# EAGLE schematic cardimetry_schematic (EAGLE 9.7.0)
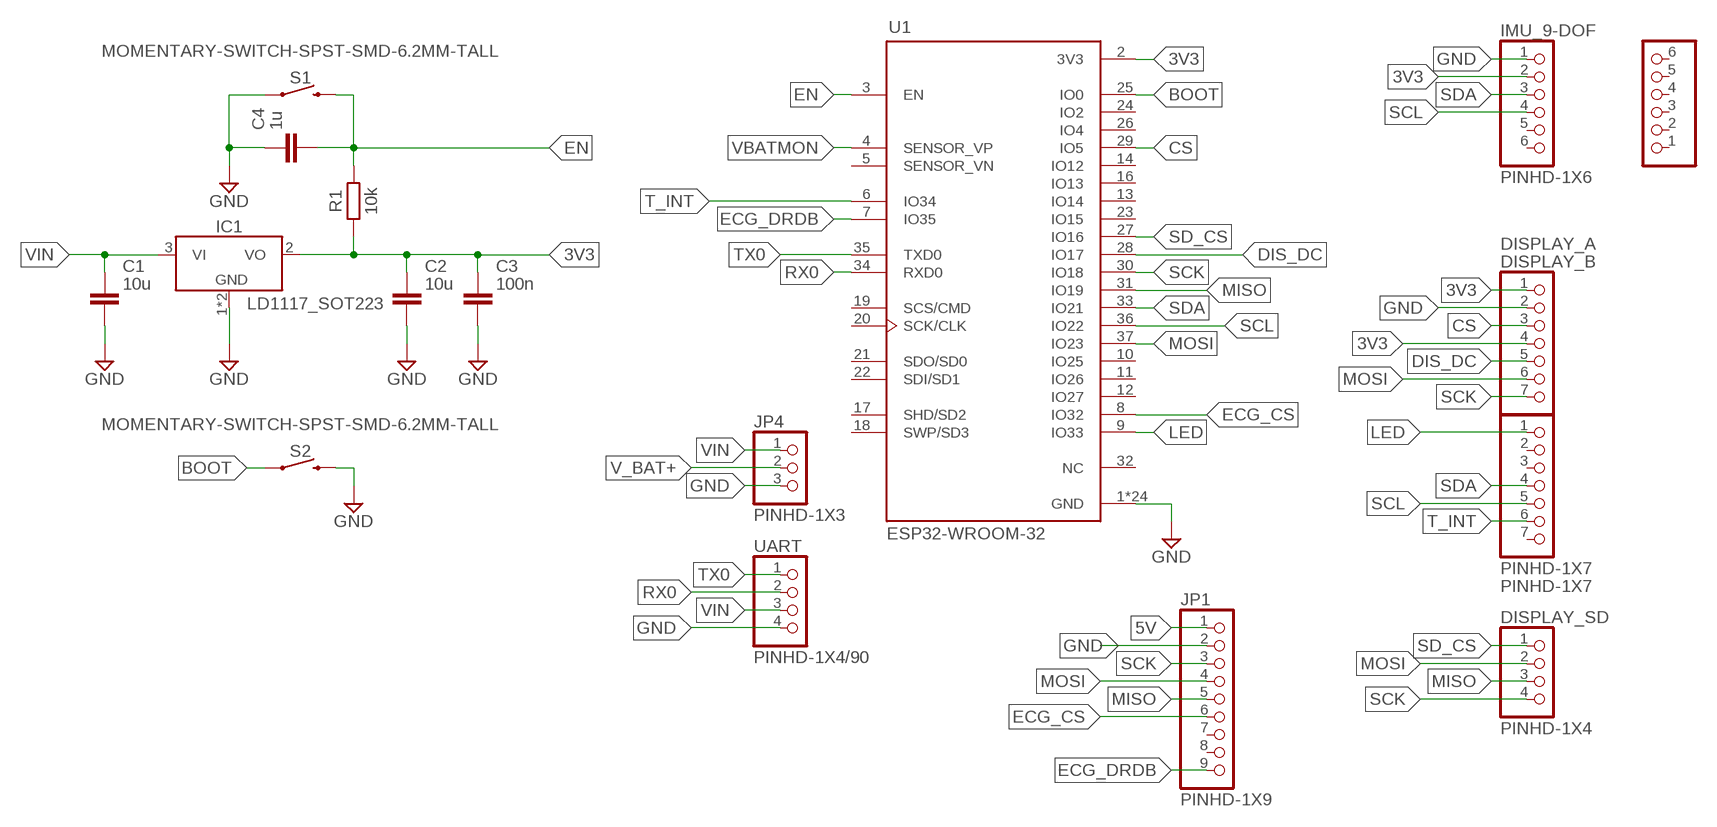
[diagram p0: schematic, sheet 1]

## Parts
C1  10u  C_CHIP-0805(2012-METRIC)  [CAPC2012X110]
C2  10u  C_CHIP-0805(2012-METRIC)  [CAPC2012X110]
C3  100n  C_CHIP-0805(2012-METRIC)  [CAPC2012X110]
C4  1u  C_CHIP-0805(2012-METRIC)  [CAPC2012X110]
DISPLAY_A  PINHD-1X7  [1X07]
DISPLAY_B  PINHD-1X7  [1X07]
DISPLAY_SD  PINHD-1X4  [1X04]
IC1  LD1117_SOT223  [SOT230P700X170-4]
IMU_9-DOF  PINHD-1X6  [1X06]
JP1  PINHD-1X9  [1X09]
JP3  PINHD-1X6  [1X06]
JP4  PINHD-1X3  [1X03]
R1  10k  R_CHIP-0805(2012-METRIC)  [RESC2012X65]
S1  MOMENTARY-SWITCH-SPST-SMD-6.2MM-TALL  [TACTILE_SWITCH_SMD_6.2MM_TALL]
S2  MOMENTARY-SWITCH-SPST-SMD-6.2MM-TALL  [TACTILE_SWITCH_SMD_6.2MM_TALL]
U1  ESP32-WROOM-32  [MODULE_ESP32-WROOM-32]
UART  PINHD-1X4/90  [1X04/90]

## Nets
3V3: C2.1 C3.1 DISPLAY_A.1 DISPLAY_A.4 IC1.2(VO) IMU_9-DOF.2 R1.1 U1.2(3V3)
5V: JP1.1
BOOT: S2.A2 U1.25(IO0)
CS: DISPLAY_A.3 U1.29(IO5)
DIS_DC: DISPLAY_A.5 U1.28(IO17)
ECG_CS: JP1.6 U1.8(IO32)
ECG_DRDB: JP1.9 U1.7(IO35)
EN: C4.2 R1.2 S1.B2 U1.3(EN)
GND: C1.2 C2.2 C3.2 C4.1 DISPLAY_A.2 IC1.1(GND) IC1.4(GND) IMU_9-DOF.1 JP1.2 JP4.3 S1.A2 S2.B2 U1.1(GND) U1.15(GND) U1.38(GND) U1.39_1(GND) U1.39_2(GND) U1.39_3(GND) U1.39_4(GND) U1.39_5(GND) U1.39_6(GND) U1.39_7(GND) U1.39_8(GND) U1.39_9(GND) U1.39_10(GND) U1.39_11(GND) U1.39_12(GND) U1.39_13(GND) U1.39_14(GND) U1.39_15(GND) U1.39_16(GND) U1.39_17(GND) U1.39_18(GND) U1.39_19(GND) U1.39_20(GND) U1.39_21(GND) UART.4
LED: DISPLAY_B.1 U1.9(IO33)
MISO: DISPLAY_SD.3 JP1.5 U1.31(IO19)
MOSI: DISPLAY_A.6 DISPLAY_SD.2 JP1.4 U1.37(IO23)
RX0: U1.34(RXD0) UART.2
SCK: DISPLAY_A.7 DISPLAY_SD.4 JP1.3 U1.30(IO18)
SCL: DISPLAY_B.5 IMU_9-DOF.4 U1.36(IO22)
SD_CS: DISPLAY_SD.1 U1.27(IO16)
SDA: DISPLAY_B.4 IMU_9-DOF.3 U1.33(IO21)
T_INT: DISPLAY_B.6 U1.6(IO34)
TX0: U1.35(TXD0) UART.1
V_BAT+: JP4.2
VBATMON: U1.4(SENSOR_VP)
VIN: C1.1 IC1.3(VI) JP4.1 UART.3
Unconnected: DISPLAY_B.2 DISPLAY_B.3 DISPLAY_B.7 IMU_9-DOF.5 IMU_9-DOF.6 JP1.7 JP1.8 JP3.1 JP3.2 JP3.3 JP3.4 JP3.5 JP3.6 U1.5(SENSOR_VN) U1.10(IO25) U1.11(IO26) U1.12(IO27) U1.13(IO14) U1.14(IO12) U1.16(IO13) U1.17(SHD/SD2) U1.18(SWP/SD3) U1.19(SCS/CMD) U1.20(SCK/CLK) U1.21(SDO/SD0) U1.22(SDI/SD1) U1.23(IO15) U1.24(IO2) U1.26(IO4) U1.32(NC)

## Library data of the parts
C1-C4 = Capacitor:C: Capacitor - Generic; CATEGORY: Capacitor
DISPLAY_A DISPLAY_B = Connector:PINHD-1X7: PIN HEADER; CATEGORY: Headers; DESCRIPTION: Header, Straight, 7 Position; MANUFACTURER: Generic; MPN: Generic; OPERATING_TEMPERATURE: Generic; PART_STATUS: Active; PITCH: 0.100" (2.54mm); ROHS_COMPLIANCE: Generic; SERIES: Generic; SUB-CATEGORY: Headers, Male Pins; TYPE: Board to Board or Cable, Unshrouded, Through Hole, Straight
DISPLAY_SD = Connector:PINHD-1X4: PIN HEADER; CATEGORY: Headers; DESCRIPTION: Header, Straight, 4 Position; MANUFACTURER: Generic; MPN: Generic; OPERATING_TEMPERATURE: Generic; PART_STATUS: Active; PITCH: 0.100" (2.54mm); ROHS_COMPLIANCE: Generic; SERIES: Generic; SUB-CATEGORY: Headers, Male Pins; TYPE: Board to Board or Cable, Unshrouded, Through Hole, Straight
IC1 = IC_Power-Management:LD1117: Adjustable and fixed positive voltage regulator Reference Datasheet <https://www.st.com/content/ccc/resource/technical/document/datasheet/99/3b/7d/91/91/51/4b/be/CD00000544.pdf/files/CD00000544.pdf/jcr:content/translations/en.CD00000544.pdf>; CATEGORY: IC_Linear; DESCRIPTION: Adjustable voltage regulator; MANUFACTURER: STMicroelectronics; MPN: Generic; SERIES: LM1117; SUB-CATEGORY: Voltage Regulator; TYPE: Linear
IMU_9-DOF JP3 = Connector:PINHD-1X6: PIN HEADER; CATEGORY: Headers; DESCRIPTION: Header, Straight, 6 Position; MANUFACTURER: Generic; MPN: Generic; OPERATING_TEMPERATURE: Generic; PART_STATUS: Active; PITCH: 0.100" (2.54mm); ROHS_COMPLIANCE: Generic; SERIES: Generic; SUB-CATEGORY: Headers, Male Pins; TYPE: Board to Board or Cable, Unshrouded, Through Hole, Straight
JP1 = Connector:PINHD-1X9: PIN HEADER; CATEGORY: Headers; DESCRIPTION: Header, Straight, 9 Position; MANUFACTURER: Generic; MPN: Generic; OPERATING_TEMPERATURE: Generic; PART_STATUS: Active; PITCH: 0.100" (2.54mm); ROHS_COMPLIANCE: Generic; SERIES: Generic; SUB-CATEGORY: Headers, Male Pins; TYPE: Board to Board or Cable, Unshrouded, Through Hole, Straight
JP4 = Connector:PINHD-1X3: PIN HEADER; CATEGORY: Headers; DESCRIPTION: Header, Straight, 3 Position; MANUFACTURER: Generic; MPN: Generic; OPERATING_TEMPERATURE: Generic; PART_STATUS: Active; PITCH: 0.100" (2.54mm); ROHS_COMPLIANCE: Generic; SERIES: Generic; SUB-CATEGORY: Headers, Male Pins; TYPE: Board to Board or Cable, Unshrouded, Through Hole, Straight
R1 = Resistor:R: Resistor Fixed - Generic; CATEGORY: Resistor; SUB-CATEGORY: Fixed
S1 S2 = SparkFun-Switches:MOMENTARY-SWITCH-SPST: Momentary Switch (Pushbutton) - SPST Normally-open (NO) SPST momentary switches (buttons, pushbuttons). Variants PTH-12MM - 12mm square, through-hole Momentary Pushbutton Switch - 12mm Square <https://www.sparkfun.com/products/9190> (COM-09190) PTH-6.0MM, PTH-6.0MM-KIT - 6.0mm square, through-hole Mini Pushbutton Switch <https://www.sparkfun.com/products/97> (COM-00097) KIT package intended for soldering kit's - only one side of pads' copper is exposed. PTH-RIGHT-ANGLE-KIT - Right-angle, through-hole Right Angle Tactile Button <https://www.sparkfun.com/products/10791> - Used on SparkFun BigTime Watch Kit <https://www.sparkfun.com/products/11734> SMD-12MM - 12mm square, surface-mount Tactile Button - SMD (12mm) <https://www.sparkfun.com/products/12993> (COM-12993) Used on SparkFun PicoBoard <https://www.sparkfun.com/products/11888> SMD-4.5MM - 4.5mm Square Trackball Switch Used on SparkFun Blackberry Trackballer Breakout <https://www.sparkfun.com/products/13169> SMD-4.6MMX2.8MM - 4.60mm x 2.80mm, surface mount Used on SparkFun Pro Micro - RP2040 <https://www.sparkfun.com/products/17717> SMD-5.2MM, SMD-5.2-REDUNDANT - 5.2mm square, surface-mount Mini Pushbutton Switch - SMD <https://www.sparkfun.com/products/8720> (COM-08720) Used on Arduino Pro Mini <https://www.sparkfun.com/products/11114> REDUNDANT package connects both switch circuits together SMD-6.0X3.5MM - 6.0 x 3.5mm, surface mount Momentary Reset Switch SMD <https://www.sparkfun.com/products/8229> (COM-08229) SMD-6.2MM-TALL - 6.2mm square, surface mount Tactile Button - SMD (6mm) <https://www.sparkfun.com/products/12992> Used on SparkFun Digital Sandbox <https://www.sparkfun.com/products/12651> SMD-RIGHT-ANGLE - Right-angle, surface mount Used on SparkFun Block for Intel® Edison - Arduino <https://www.sparkfun.com/products/13036>; PROD_ID: SWCH-11966; SF_SKU: COM-12992
U1 = ESP32-WROOM-32:ESP32-WROOM-32: Check availability <https://pricing.snapeda.com/parts/ESP32-WROOM-32/Espressif%20Systems/view-part?ref=eda>; AVAILABILITY: Not in stock; CHECK_PRICES: https://www.snapeda.com/parts/ESP32-WROOM-32/Espressif+Systems/view-part/?ref=eda; DESCRIPTION: Bluetooth, WiFi 802.11b/g/n, Bluetooth v4.2 +EDR, Class 1, 2 and 3 Transceiver Module 2.4GHz ~ 2.5GHz Antenna Not Included, U.FL Surface Mount; MF: Espressif Systems; MP: ESP32-WROOM-32; PACKAGE: Non Standard Espressif Systems; PRICE: None; SNAPEDA_LINK: https://www.snapeda.com/parts/ESP32-WROOM-32/Espressif+Systems/view-part/?ref=snap
UART = Connector:PINHD-1X4: PIN HEADER; CATEGORY: Headers; DESCRIPTION: Header, Right Angle, 4 Position; MANUFACTURER: Generic; MPN: Generic; OPERATING_TEMPERATURE: Generic; PART_STATUS: Active; PITCH: 0.100" (2.54mm); ROHS_COMPLIANCE: Generic; SERIES: Generic; SUB-CATEGORY: Headers, Male Pins; TYPE: Board to Board or Cable, Unshrouded, Through Hole, Right Angle